# EAGLE design bbb_xbee (EAGLE 6.4)
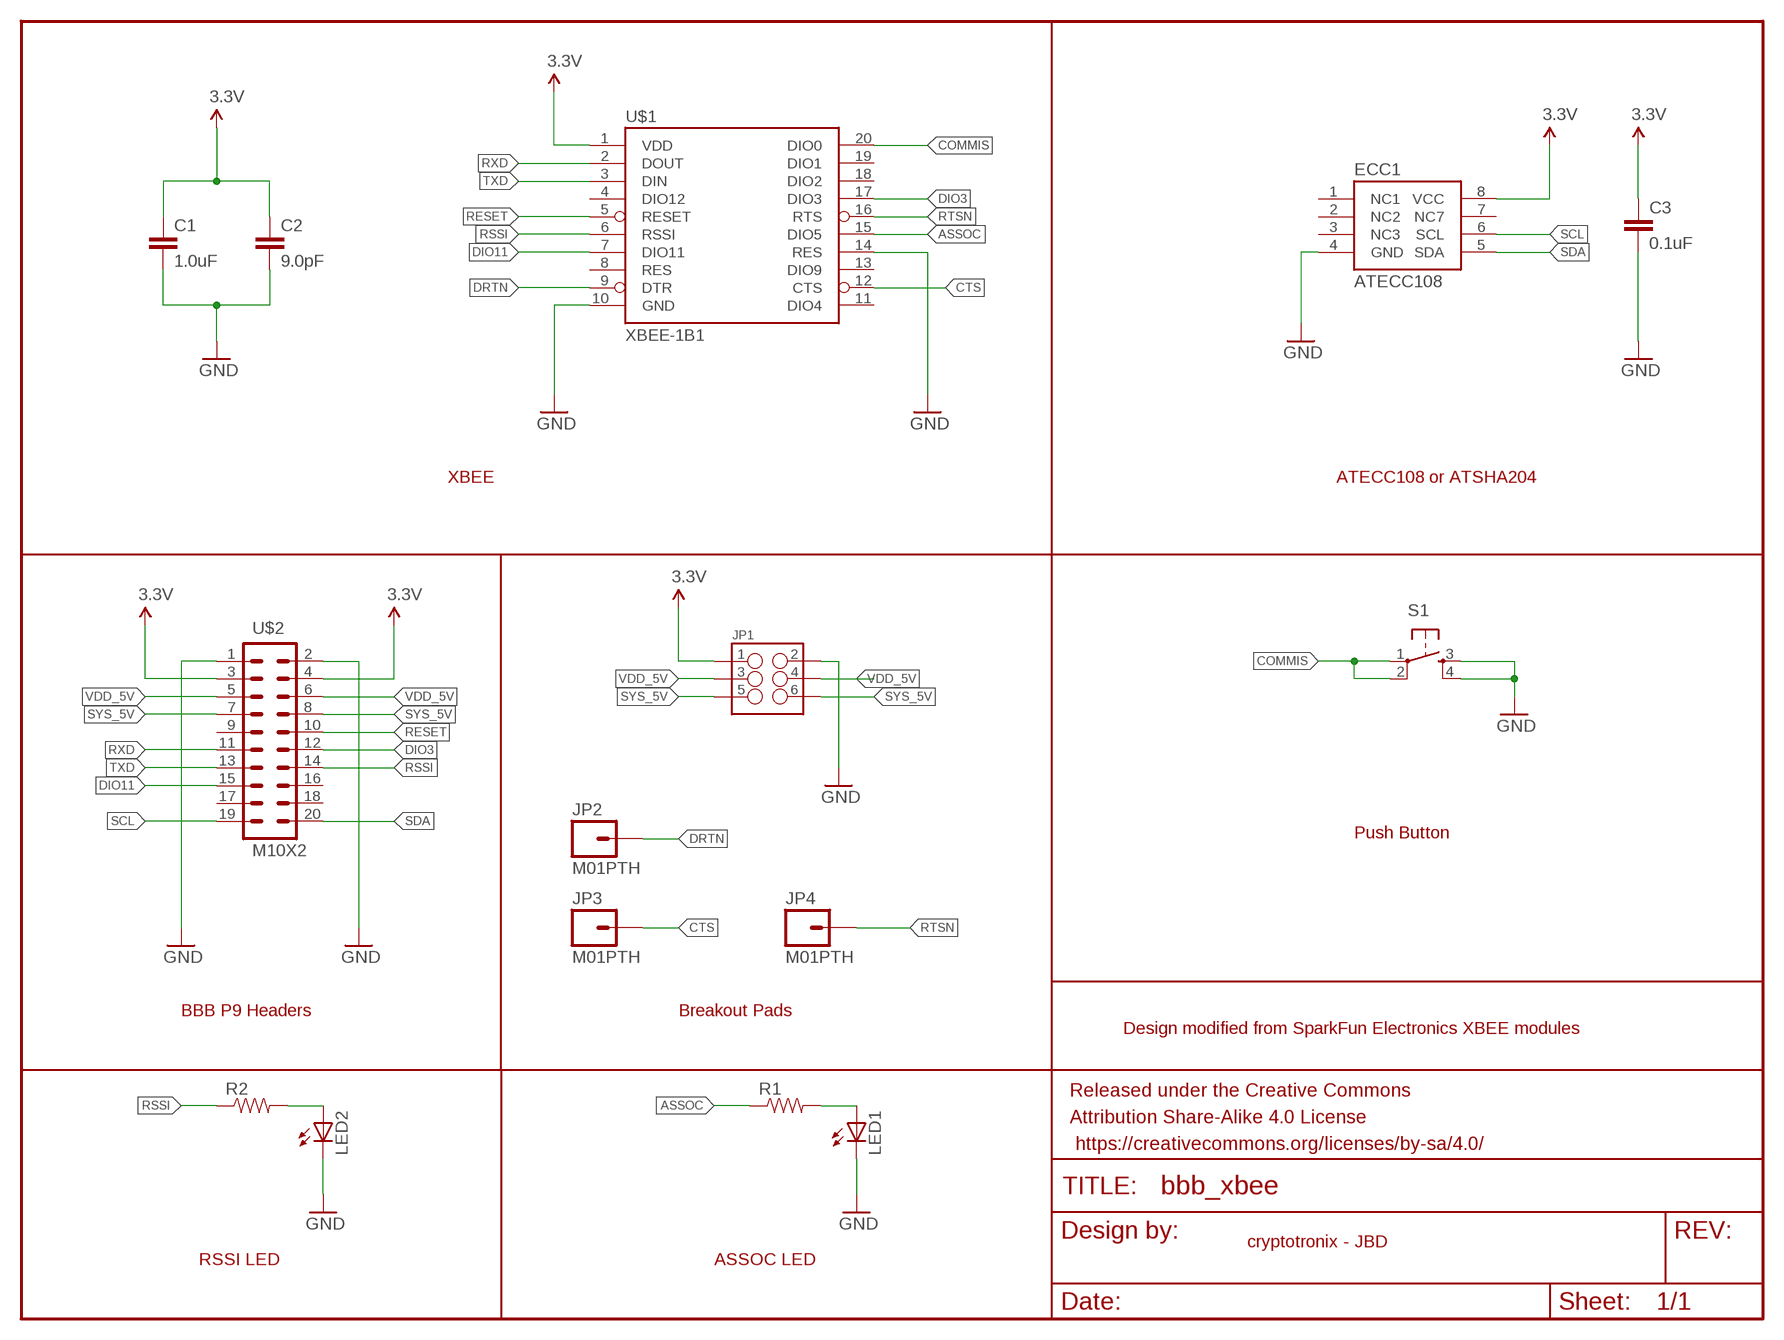
[diagram p0: schematic, sheet 1]

## Parts
C1  1.0uF  1.0UF-16V-10%(0603)  [0603-CAP]
C2  9.0pF  9.0PF-50V-10%(0603)  [0603-CAP]
C3  0.1uF  0.1UF-100V-10%(0603)  [0603-CAP]
ECC1  ATECC108  [SOIC8]
FRAME1  FRAME-LETTER  [CREATIVE_COMMONS]
JP1  M03X22X3_SILK_SM  [2X3]
JP2  M01PTH  [1X01]
JP3  M01PTH  [1X01]
JP4  M01PTH  [1X01]
LED1  LED-RED0603  [LED-0603]
LED2  LED-BLUE0603  [LED-0603]
R1  RESISTOR0603  [0603-RES]
R2  RESISTOR0603  [0603-RES]
S1  TAC_SWITCHPTH  [TACTILE-PTH]
U$1  XBEE-1B1  [XBEE-1]
U$2  M10X2  [2X10]

## Nets
3.3V: C1.1 C2.1 C3.1 ECC1.8(VCC) JP1.1 U$1.1(VDD) U$2.3 U$2.4
ASSOC: R1.1 U$1.15(DIO5)
COMMIS: S1.1 S1.2 U$1.20(DIO0)
CTS: JP3.1 U$1.12(CTS)
DIO3: U$1.17(DIO3) U$2.12
DIO11: U$1.7(DIO11) U$2.15
DRTN: JP2.1 U$1.9(DTR)
GND: C1.2 C2.2 C3.2 ECC1.4(GND) JP1.2 LED1.C LED2.C S1.3 S1.4 U$1.10(GND) U$1.14(RES) U$2.1 U$2.2
N$1: LED1.A R1.2
N$2: LED2.A R2.2
RESET: U$1.5(RESET) U$2.10
RSSI: R2.1 U$1.6(RSSI) U$2.14
RTSN: JP4.1 U$1.16(RTS)
RXD: U$1.2(DOUT) U$2.11
SCL: ECC1.6(SCL) U$2.19
SDA: ECC1.5(SDA) U$2.20
SYS_5V: JP1.5 JP1.6 U$2.7 U$2.8
TXD: U$1.3(DIN) U$2.13
VDD_5V: JP1.3 JP1.4 U$2.5 U$2.6
Unconnected: ECC1.1(NC1) ECC1.2(NC2) ECC1.3(NC3) ECC1.7(NC7) U$1.4(DIO12) U$1.8(RES) U$1.11(DIO4) U$1.13(DIO9) U$1.18(DIO2) U$1.19(DIO1) U$2.9 U$2.16 U$2.17 U$2.18

## Notes on the sheet
- XBEE | ATECC108 or ATSHA204
- Push Button
- BBB P9 Headers | Breakout Pads
- Design modified from SparkFun Electronics XBEE modules
- cryptotronix - JBD
- RSSI LED | ASSOC LED

## Library data of the parts
C1 = SparkFun-Capacitors:1.0UF-16V-10%(0603): CAP-00868; PROD_ID: CAP-00868
C2 = SparkFun-Capacitors:9.0PF-50V-10%(0603): CAP-09341; PROD_ID: CAP-09341
C3 = SparkFun-Capacitors:0.1UF-100V-10%(0603): CAP-08390; PROD_ID: CAP-08390
ECC1 = cryptotronix:ATECC108: ATECC108: Provides ECDSA with NIST curves P256, B283, and K283. Also, a RNG, 8.5Kb EEPROM. 2.0V - 5.5V.
FRAME1 = SparkFun-Aesthetics:FRAME-LETTER: Schematic Frame Standard 8.5x11 US Letter frame
JP1 = SparkFun-Connectors:M03X2: 2x3 .1" header. Shrouded, with keying- CONN-10681 SMT- CONN-11415 Pogo pins- HW-11044
JP2-JP4 = SparkFun-Connectors:M01: Header 1 Standard 1-pin 0.1" header. Use with straight break away headers (SKU : PRT-00116), right angle break away headers (PRT-00553), swiss pins (PRT-00743), machine pins (PRT-00117), and female headers (PRT-00115).
LED1 = SparkFun-LED:LED-RED: Assorted Red LEDs LilyPad 1206- DIO-09912 1206- DIO-00809 0603- DIO-00819; PROD_ID: DIO-00819; VALUE: RED
LED2 = SparkFun-LED:LED-BLUE: Blue LEDs for production use Various blue LEDs stocked by SparkFun production 0603 - DIO-08575 Rebel - DIO-09553 1206 - DIO-09911; PROD_ID: DIO-08575; VALUE: BLUE
R1 R2 = SparkFun-Resistors:RESISTOR: Resistor Basic schematic elements and footprints for 0603, 1206, and PTH resistors.
S1 = SparkFun-Electromechanical:TAC_SWITCH: Momentary Switch Button commonly used for reset or general input. Spark Fun Electronics SKU : COM-00097 SMT- SWCH-08247
U$1 = SparkFun-RF:XBEE-1: Xbee module footprints SMT header is CONN-09042.
U$2 = SparkFun-Connectors:M10X2: This was SPECIALLY designed to be used with our Graphic LCD Backpack. Be sure you want to use this! It is not only staggered on each line of header holes, but IT IS ALSO offset of the center point of the top and bottom lines by 5 mil. This causes the headers to lock into place on the "standard" footprint on the LCD screen. The extra squares on the tdocu layer are there simply to reference other pins (if you were to actually populate a longer header than ten long - this is what we do with the backpacks).

## Board
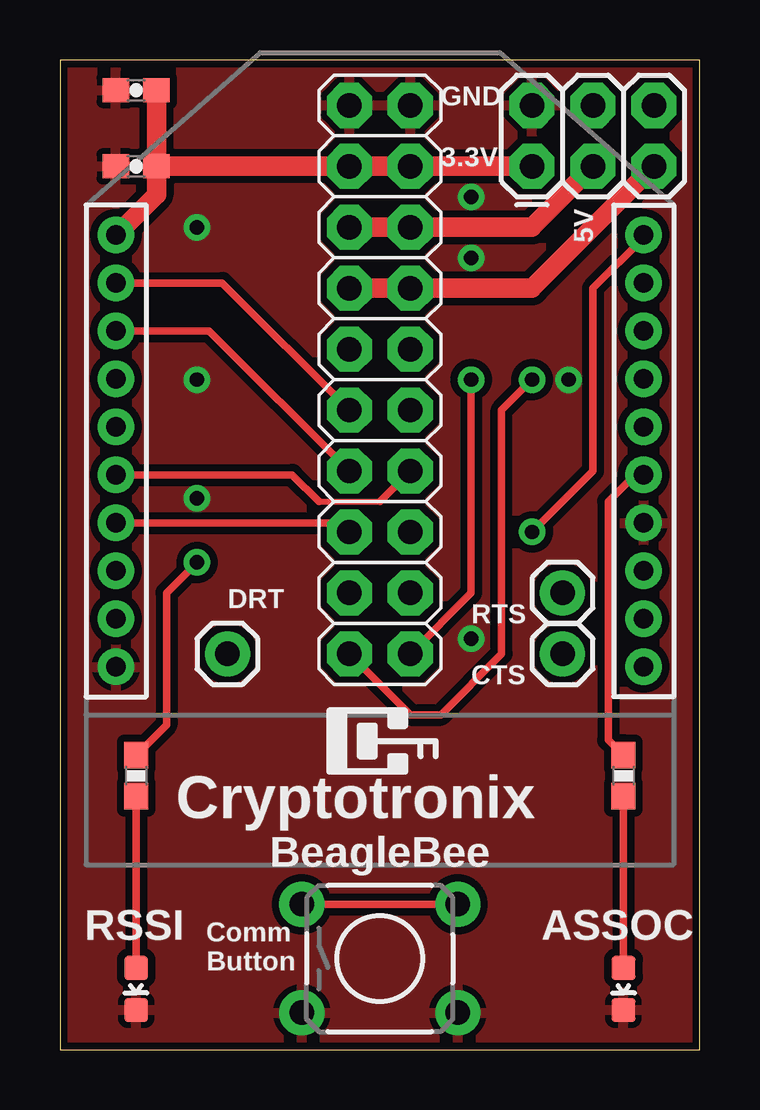
[diagram p1: board, top side]
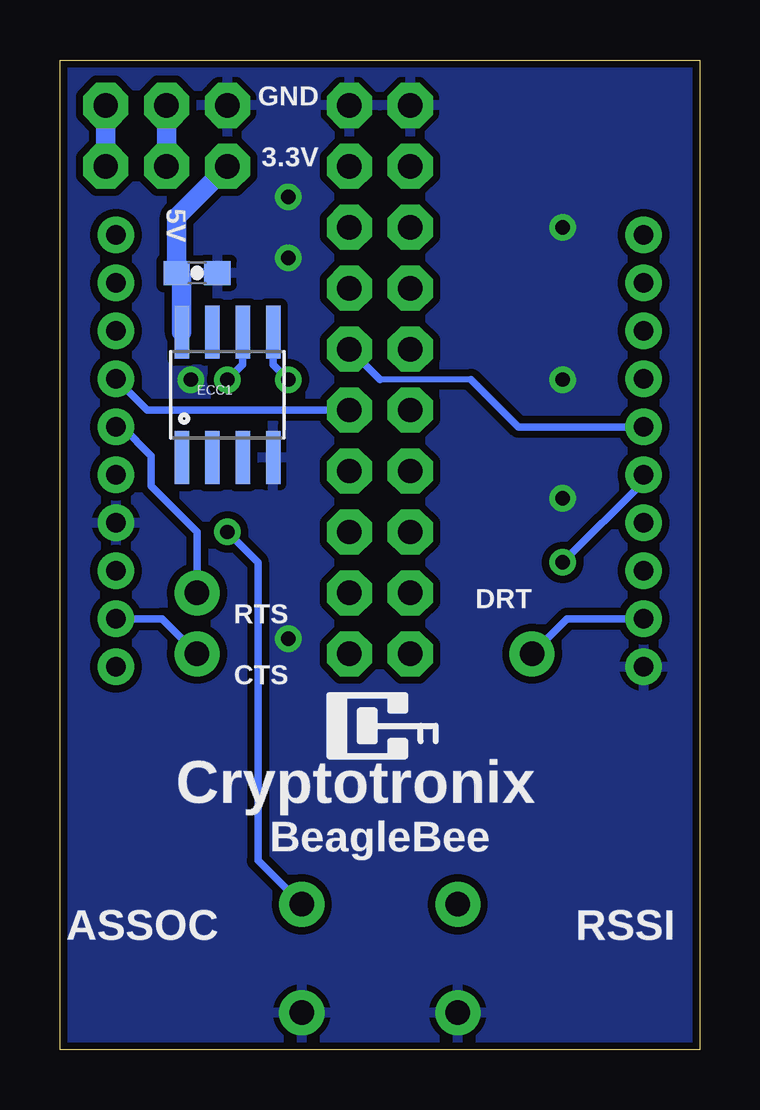
[diagram p2: board, bottom side, seen from below]

Size 26.67 x 41.27 mm. Coordinates in mm from the lower left corner, seen from the top.
Outline: 0,0 26.67,0 26.67,41.27 0,41.27 0,0
Copper layers (1*16): Top 0.035mm / dielectric 1.5mm / Bottom 0.035mm
Design rules "SparkFun": minimum track width 8mil, minimum drill 20mil, track to track 8mil, track to pad 8mil, pad to pad 8mil, via to via 8mil, smd to smd 8mil, copper to edge 10mil, drill to drill 8mil, minimum pad ring 12mil, minimum via ring 10mil, stop-mask expansion 4mil, vias tented up to drill 25mil, thermal gap 10mil

### Footprints (pad centres in the part's own frame; a part is rotated, then mirrored left to right if it is on the bottom)
0603-CAP = smd 1.1 x 1: 1 -0.85,0; 2 0.85,0
SOIC8 = smd 0.61 x 2.21: 1 -1.905,-2.616; 2 -0.635,-2.616; 3 0.635,-2.616; 4 1.905,-2.616; 5 1.905,2.616; 6 0.635,2.616; 7 -0.635,2.616; 8 -1.905,2.616
2X3 = drill 1.016 pad 1.88 octagon: 1 0,0; 2 0,2.54; 3 2.54,0; 4 2.54,2.54; 5 5.08,0; 6 5.08,2.54
1X01 = drill 1.016 pad 1.88: 1 0,0
LED-0603 = smd 1 x 1: A 0,-0.877; C 0,0.877
0603-RES = smd 1.1 x 1: 1 -0.85,0; 2 0.85,0
TACTILE-PTH = drill 1.016 pad 1.88: 1 -3.251,2.261; 2 3.251,2.261; 3 -3.251,-2.261; 4 3.251,-2.261
XBEE-1 = drill 0.8 pad 1.524: 1 -11,20; 2 -11,18; 3 -11,16; 4 -11,14; 5 -11,12; 6 -11,10; 7 -11,8; 8 -11,6; 9 -11,4; 10 -11,2; 11 11,2; 12 11,4; 13 11,6; 14 11,8; 15 11,10; 16 11,12; 17 11,14; 18 11,16; 19 11,18; 20 11,20
2X10 = drill 1.016 pad 1.88 octagon: 1 -11.43,-1.27; 2 -11.43,1.27; 3 -8.89,-1.27; 4 -8.89,1.27; 5 -6.35,-1.27; 6 -6.35,1.27; 7 -3.81,-1.27; 8 -3.81,1.27; 9 -1.27,-1.27; 10 -1.27,1.27; 11 1.27,-1.27; 12 1.27,1.27; 13 3.81,-1.27; 14 3.81,1.27; 15 6.35,-1.27; 16 6.35,1.27; 17 8.89,-1.27; 18 8.89,1.27; 19 11.43,-1.27; 20 11.43,1.27

### Placement (x,y rotation side)
C1  3.17,36.83 180 top
C2  3.17,40.01 180 top
C3  20.96,32.38 0 bottom
ECC1  19.69,27.3 0 bottom
FRAME1  19.69,-12.7 0 top  (outside the outline)
JP1  19.69,36.83 0 top
JP2  6.98,16.51 0 top
JP3  20.96,16.51 0 top
JP4  20.96,19.05 0 top
LED1  23.5,2.54 180 top
LED2  3.17,2.54 180 top
R1  23.5,11.43 270 top
R2  3.17,11.43 270 top
S1  13.33,3.81 0 top
U$1  13.33,13.97 0 top
U$2  13.33,27.94 270 top

### Tracks (layer width: path | path; a pad name or v marks a point on that pad's centre or on a via)
3.3V
  Top 0.813: C1.1 U$2.3 U$2.4 JP1.1 | C1.1 C2.1 | C1.1 4.03,35.66 U$1.1
  Bottom 0.813: ECC1.8 21.59,32.17 C3.1 21.81,34.71 JP1.1
ASSOC
  Top 0.305: 23.5,12.7 R1.1 22.86,12.91 22.86,22.86 23.97,23.97 U$1.15
COMMIS  (via drill 0.6)
  Top 0.305: S1.1 S1.2 | U$1.20 24.34,33.86 22.23,31.75 22.23,24.13 v19.69,21.59
  Bottom 0.305: v19.69,21.59 18.42,20.32 18.42,7.9 S1.2
CTS
  Bottom 0.305: U$1.12 22.42,17.97 JP3.1
DIO3
  Bottom 0.305: U$2.12 23.04,26.67 U$1.17
DIO11
  Top 0.305: U$1.7 11.69,21.97 U$2.15
DRTN
  Bottom 0.305: U$1.9 5.52,17.97 JP2.1
GND  (via drill 0.6)
  other vias: 5.71,34.29 5.71,27.94 17.15,17.14 17.15,33.02 17.15,35.56 21.21,27.94 5.71,22.99
  pour Bottom (isolate 0.305): -0.64,0 -0.64,43.18 27.31,43.18 27.31,0
  pour Top (isolate 0.305): -0.64,0 27.31,0 27.31,43.18 -0.64,43.18
N$1
  Top 0.305: R1.2 LED1.A
N$2
  Top 0.305: R2.2 LED2.A
RESET
  Bottom 0.254: 9.53,27.94 13.33,27.94
  Bottom 0.305: U$1.5 7.55,25.97 9.53,27.94 | 13.33,27.94 U$2.10
RSSI  (via drill 0.6)
  Top 0.254: 10.79,22.86 13.33,22.86
  Top 0.305: U$1.6 9.69,23.97 10.79,22.86 | 13.33,22.86 U$2.14 | v5.71,20.32 4.45,19.05 4.45,13.55 R2.1
  Bottom 0.305: U$1.6 2.33,23.7 v5.71,20.32
RTSN
  Bottom 0.305: U$1.16 24.07,25.97 22.86,24.77 22.86,23.5 20.96,21.59 JP4.1
RXD
  Top 0.305: U$1.2 6.76,31.97 U$2.11
SCL  (via drill 0.6)
  Top 0.305: U$2.19 14.61,13.97 15.88,13.97 18.42,16.51 18.42,26.67 v19.69,27.94
  Bottom 0.305: ECC1.6 19.05,28.57 v19.69,27.94
SDA  (via drill 0.6)
  Top 0.305: v17.15,27.94 17.15,19.05 U$2.20
  Bottom 0.305: ECC1.5 17.78,28.57 v17.15,27.94
SYS_5V
  Top 0.813: U$2.7 U$2.8 19.69,31.75 JP1.5
  Bottom 0.813: JP1.6 JP1.5
TXD
  Top 0.305: U$1.3 6.22,29.97 U$2.13
VDD_5V
  Top 0.813: U$2.5 U$2.6 19.69,34.29 JP1.3
  Bottom 0.813: JP1.4 JP1.3

### Text on the board
tPlace: GND | 3.3V | 5V | DRT | RTS | CTS | Cryptotronix | BeagleBee | RSSI | ASSOC | Comm / Button
bPlace: GND | 3.3V | 5V | DRT | RTS | CTS | Cryptotronix | BeagleBee | RSSI | ASSOC
tDocu: Cryptotronix - JBD | Adapted from SparkFun Electronics XBEE Modules